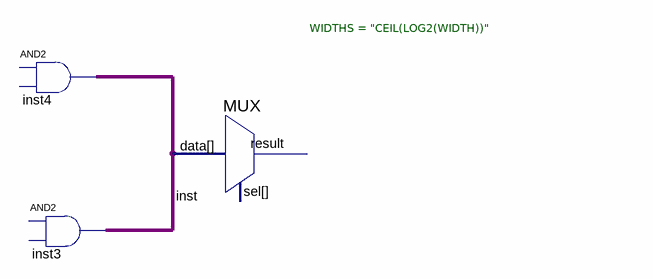
[diagram p0: schematic sheet]
// Quartus schematic Mux2_1.bdf as structural Verilog: 3 symbols, 0 pins
module Mux2_1 (
);

  wire inst4_out;

  // AND2 inst4 has open pins: IN1=open, IN2=open, OUT=inst4_out
  // AND2 inst3 has open pins: IN1=open, IN2=open, OUT=inst4_out
  MUX #(.WIDTHS("CEIL(LOG2(WIDTH))")) inst (.data(inst4_out));  // open: sel, result
endmodule
